# EAGLE design shieldv1.0 (EAGLE 7.5.0)
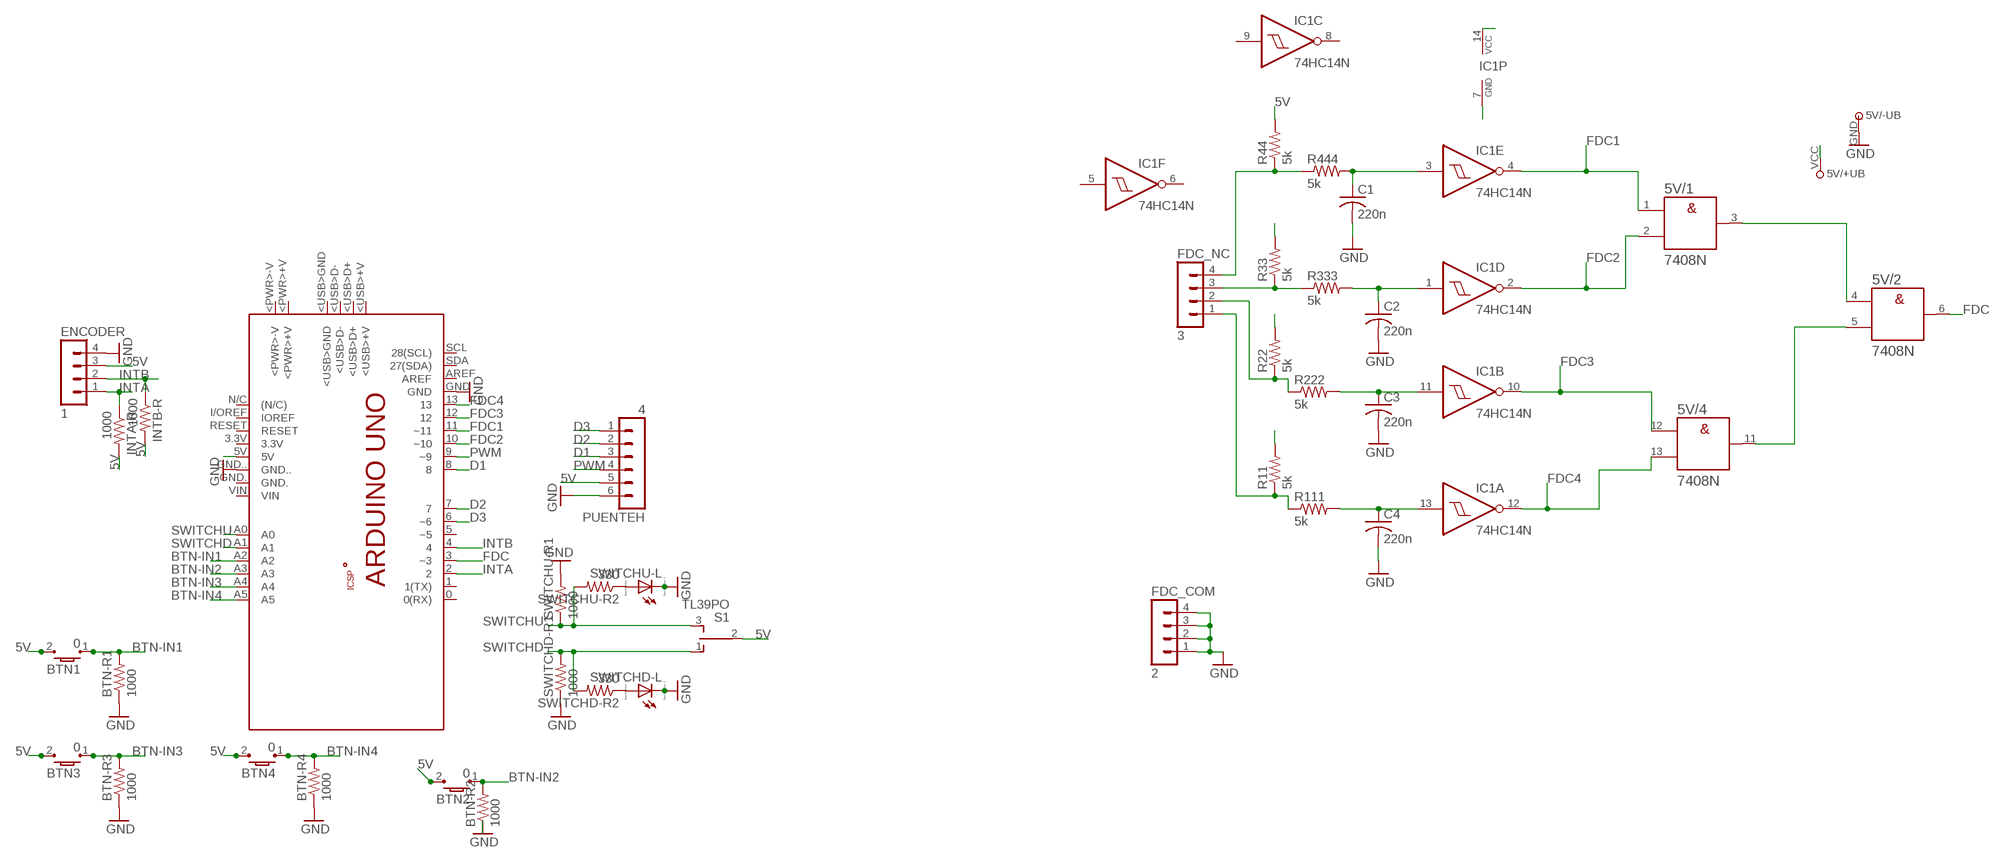
[diagram p0: schematic, sheet 1]

## Parts
5V  7408N  [DIL14]
BTN1  0  TL3302-J  [TL3303_J]
BTN2  0  TL3302-J  [TL3303_J]
BTN3  0  TL3302-J  [TL3303_J]
BTN4  0  TL3302-J  [TL3303_J]
BTN-R1  1000  R-US_0204/7  [0204/7]
BTN-R2  1000  R-US_0204/7  [0204/7]
BTN-R3  1000  R-US_0204/7  [0204/7]
BTN-R4  1000  R-US_0204/7  [0204/7]
C1  220n  C-US025-030X050  [C025-030X050]
C2  220n  C-US025-030X050  [C025-030X050]
C3  220n  C-US025-030X050  [C025-030X050]
C4  220n  C-US025-030X050  [C025-030X050]
ENCODER  1  MA04-1  [MA04-1]
FDC_COM  2  MA04-1  [MA04-1]
FDC_NC  3  MA04-1  [MA04-1]
IC1  74HC14N  [DIL14]
INTA-R  1000  R-US_0204/7  [0204/7]
INTB-R  1000  R-US_0204/7  [0204/7]
PCB1  ARDUINO_UNO  [ARDUINO_UNO]
PUENTEH  4  MA06-1  [MA06-1]
R11  5k  R-US_0204/7  [0204/7]
R22  5k  R-US_0204/7  [0204/7]
R33  5k  R-US_0204/7  [0204/7]
R44  5k  R-US_0204/7  [0204/7]
R111  5k  R-US_0204/7  [0204/7]
R222  5k  R-US_0204/7  [0204/7]
R333  5k  R-US_0204/7  [0204/7]
R444  5k  R-US_0204/7  [0204/7]
S1  TL39PO  [TL3XPO]
SWITCHD-L  LED_ELD260  [LED_LD260]
SWITCHD-R1  1000  R-US_0204/7  [0204/7]
SWITCHD-R2  330  R-US_0204/7  [0204/7]
SWITCHU-L  LED_ELD260  [LED_LD260]
SWITCHU-R1  1000  R-US_0204/7  [0204/7]
SWITCHU-R2  330  R-US_0204/7  [0204/7]

## Nets
5V: 5V.VCC(/+UB:+UB) BTN1.2 BTN2.2 BTN3.2 BTN4.2 ENCODER.3 IC1.14(P:VCC) INTA-R.2 INTB-R.2 PCB1.5V PUENTEH.5 R11.2 R22.2 R33.2 R44.2 S1.2(P)
BTN-IN1: BTN1.1 BTN-R1.2 PCB1.A2
BTN-IN2: BTN2.1 BTN-R2.2 PCB1.A3
BTN-IN3: BTN3.1 BTN-R3.2 PCB1.A4
BTN-IN4: BTN4.1 BTN-R4.2 PCB1.A5
D1: PCB1.8 PUENTEH.3
D2: PCB1.7 PUENTEH.2
D3: PCB1.6(~6) PUENTEH.1
FDC: 5V.6(/2:Y) PCB1.3(~3)
FDC1: 5V.1(/1:A) IC1.4(E:O) PCB1.11(~11)
FDC2: 5V.2(/1:B) IC1.2(D:O) PCB1.10(~10)
FDC3: 5V.12(/4:A) IC1.10(B:O) PCB1.12
FDC4: 5V.13(/4:B) IC1.12(A:O) PCB1.13
GND: 5V.GND(/-UB:-UB) BTN-R1.1 BTN-R2.1 BTN-R3.1 BTN-R4.1 C1.2 C2.2 C3.2 C4.2 ENCODER.4 FDC_COM.1 FDC_COM.2 FDC_COM.3 FDC_COM.4 IC1.7(P:GND) PCB1.GND PCB1.GND.. PUENTEH.6 SWITCHD-L.K(C) SWITCHD-R1.1 SWITCHU-L.K(C) SWITCHU-R1.2
INTA: ENCODER.1 INTA-R.1 PCB1.2
INTB: ENCODER.2 INTB-R.1 PCB1.4
N$1: FDC_NC.3 R33.1 R333.1
N$3: SWITCHU-L.A SWITCHU-R2.1
N$4: SWITCHD-L.A SWITCHD-R2.1
N$5: FDC_NC.4 R44.1 R444.1
N$8: C1.1 IC1.3(E:I) R444.2
N$10: C2.1 IC1.1(D:I) R333.2
N$11: FDC_NC.2 R22.1 R222.1
N$12: C3.1 IC1.11(B:I) R222.2
N$13: FDC_NC.1 R11.1 R111.1
N$14: C4.1 IC1.13(A:I) R111.2
N$19: 5V.5(/2:B) 5V.11(/4:Y)
N$20: 5V.3(/1:Y) 5V.4(/2:A)
PWM: PCB1.9(~9) PUENTEH.4
SWITCHD: PCB1.A1 S1.1(O) SWITCHD-R1.2 SWITCHD-R2.2
SWITCHU: PCB1.A0 S1.3(S) SWITCHU-R1.1 SWITCHU-R2.2
Unconnected: 5V.8(/3:Y) 5V.9(/3:A) 5V.10(/3:B) IC1.5(F:I) IC1.6(F:O) IC1.8(C:O) IC1.9(C:I) PCB1.0(0(RX)) PCB1.1(1(TX)) PCB1.3.3V PCB1.5(~5) PCB1.+5V PCB1.<PWR>+V PCB1.<PWR>-V PCB1.<USB>+V PCB1.<USB>D+ PCB1.<USB>D- PCB1.<USB>GND PCB1.AREF PCB1.GND. PCB1.GND_ PCB1.I/OREF(IOREF) PCB1.MISO PCB1.MOSI PCB1.N/C((N/C)) PCB1.RESET PCB1.RESET. PCB1.SCK PCB1.SCL(28(SCL)) PCB1.SDA(27(SDA)) PCB1.VIN

## Library data of the parts
5V = 74ttl-din:74*08: Quad 2-input AND gate
BTN1-BTN4 = eswitch-tact:TL3302: E-Switch TL3302 Series Tactile Switch Surface mount button commonly used for reset or general input. 3.5 x 6mm packaged design. -G: Gull wing termination. Parts TL-3302-x-xxxx-x-G -J: J-Lead termination. Parts TL-3302-x-xxxx-x-J Source: http://www.e-switch.com/Portals/0/Series_Pdf/TL3302.pdf Supplier: DigiKey: http://be.digikey.com/scripts/dksearch/dksus.dll?vendor=0&keywords=TL3302
BTN-R1-BTN-R4 INTA-R INTB-R SWITCHD-R1 SWITCHD-R2 SWITCHU-R1 SWITCHU-R2 = resistor:R-US_: RESISTOR, American symbol
C1-C4 = rcl:C-US: CAPACITOR, American symbol
ENCODER FDC_COM FDC_NC = con-lstb:MA04-1: PIN HEADER; OC_FARNELL: unknown; OC_NEWARK: unknown
IC1 = 74xx-eu:74*14: Hex schmitt trigger INVERTER
PCB1 = uchile_robotics_eagle_library:ARDUINO_UNO: Device for representing an Arduino Uno board with a footprint in an EAGLE design. Created by Dave Young for Element14. More EAGLE documentation at: http://www.element14.com/community/community/knode/cadsoft_eagle
PUENTEH = con-lstb:MA06-1: PIN HEADER; OC_FARNELL: unknown; OC_NEWARK: unknown
R11 R22 R33 R44 R111 R222 R333 R444 = rcl:R-US_: RESISTOR, American symbol
S1 = switch:TL39PO: TINY SWITCH ON OFF ON Source: http://www2.produktinfo.conrad.com/datenblaetter/700000-724999/705152-da-01-de-Subminiaturschalter_TL_36YO.pdf
SWITCHD-L SWITCHU-L = eagle-ltspice:LED_E: LED Source: http://www.osram.convergy.de Source: www.luxeon.com Source: www.kingbright.com; SPICEMODEL: NONE; SPICEPREFIX: D; SPICETYPE: diode

## Board
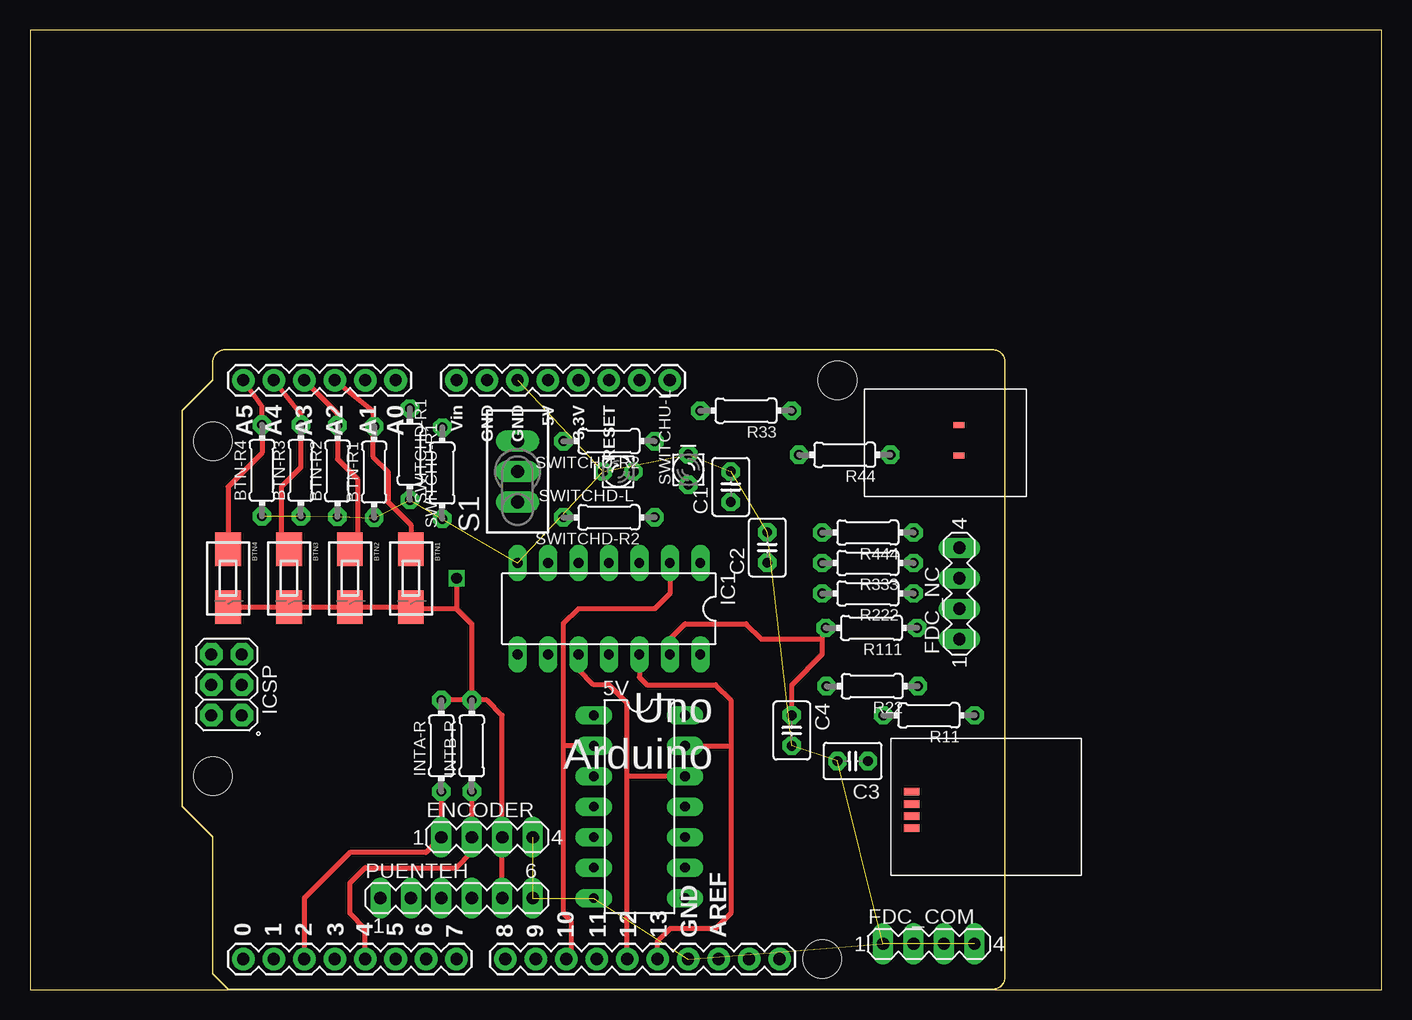
[diagram p1: board, top side]
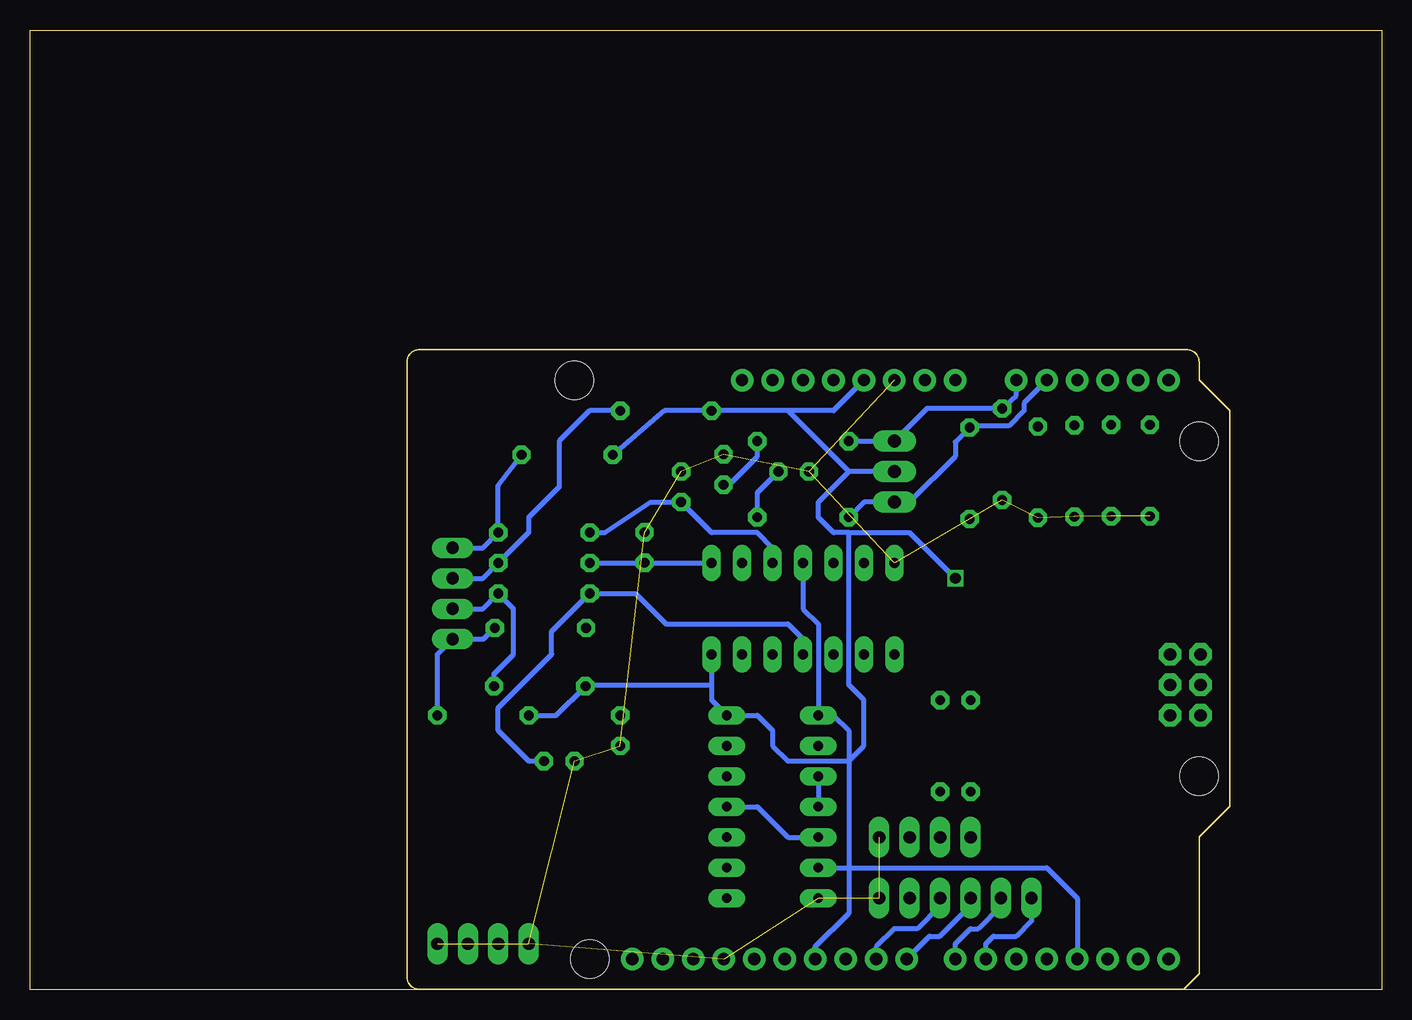
[diagram p2: board, bottom side, seen from below]

Size 112.7 x 80 mm. Coordinates in mm from the lower left corner, seen from the top.
Outline: 0,0 112.7,0 112.7,80 0,80 0,0
Copper layers (1*16): Top 0.035mm / dielectric 1.5mm / Bottom 0.035mm
Design rules "drc_config *": minimum track width 10mil, minimum drill 24mil, track to track 16mil, track to pad 10mil, pad to pad 16mil, via to via 16mil, smd to smd 16mil, copper to edge 40mil, drill to drill 8mil, minimum pad ring 14mil, minimum via ring 8mil, stop-mask expansion 4mil, vias tented up to drill 0mil, thermal gap 20mil

### Footprints (pad centres in the part's own frame; a part is rotated, then mirrored left to right if it is on the bottom)
DIL14 = drill 0.813 long: 1 -7.62,-3.81; 2 -5.08,-3.81; 3 -2.54,-3.81; 4 0,-3.81; 5 2.54,-3.81; 6 5.08,-3.81; 8 7.62,3.81; 9 5.08,3.81; 10 2.54,3.81; 11 0,3.81; 12 -2.54,3.81; 13 -5.08,3.81; GND 7.62,-3.81; VCC -7.62,3.81
TL3303_J = smd 2.794 x 2.159: 1 -2.413,0; 2 2.413,0
0204/7 = drill 0.813 octagon: 1 -3.81,0; 2 3.81,0
C025-030X050 = drill 0.813 octagon: 1 -1.27,0; 2 1.27,0
MA04-1 = drill 1.016 long: 1 -3.81,0; 2 -1.27,0; 3 1.27,0; 4 3.81,0
DIL14' = drill 0.813 long: 1 -7.62,-3.81; 2 -5.08,-3.81; 3 -2.54,-3.81; 4 0,-3.81; 5 2.54,-3.81; 6 5.08,-3.81; 7 7.62,-3.81; 8 7.62,3.81; 9 5.08,3.81; 10 2.54,3.81; 11 0,3.81; 12 -2.54,3.81; 13 -5.08,3.81; 14 -7.62,3.81
ARDUINO_UNO = drill 1.016 pad 1.88: 0 63.5,50.8; 1 60.96,50.8; 2 58.42,50.8; 3 55.88,50.8; 3.3V 35.56,2.54; 4 53.34,50.8; 5 50.8,50.8; 5V 38.1,2.54; 6 48.26,50.8; 7 45.72,50.8; 8 41.656,50.8; 9 39.116,50.8; 10 36.576,50.8; 11 34.036,50.8; 12 31.496,50.8; 13 28.956,50.8; A0 50.8,2.54; A1 53.34,2.54; A2 55.88,2.54; A3 58.42,2.54; A4 60.96,2.54; A5 63.5,2.54; AREF 23.876,50.8; GND 26.416,50.8; GND. 43.18,2.54; GND.. 40.64,2.54; I/OREF 30.48,2.54; N/C 27.94,2.54; RESET 33.02,2.54; SCL 18.796,50.8; SDA 21.336,50.8; VIN 45.72,2.54 | drill 1.016 pad 1.88 octagon: +5V 66.167,30.48; GND_ 66.167,25.4; MISO 63.627,30.48; MOSI 66.167,27.94; RESET. 63.627,25.4; SCK 63.627,27.94 | smd 1.016 x 0.508: <PWR>+V 3.861,8.814; <PWR>-V 3.861,6.274 | smd 1.27 x 0.635: <USB>+V 7.772,39.878; <USB>D+ 7.772,38.887; <USB>D- 7.772,37.871; <USB>GND 7.772,36.83 | hole 3.2: 66.04,7.62; 66.04,35.56; 15.24,50.8; 13.97,2.54
MA06-1 = drill 1.016 long: 1 -6.35,0; 2 -3.81,0; 3 -1.27,0; 4 1.27,0; 5 3.81,0; 6 6.35,0
TL3XPO = drill 1.1 pad 1.422 long: 1 -2.54,0; 2 0,0; 3 2.54,0
LED_LD260 = drill 0.813 octagon: A -1.27,0; K 1.27,0

### Placement (x,y rotation side)
5V  50.8,15.24 270 top
BTN1  31.75,34.29 270 top
BTN2  26.67,34.29 270 top
BTN3  21.59,34.29 270 top
BTN4  16.51,34.29 270 top
BTN-R1  28.69,43.13 90 top
BTN-R2  25.63,43.23 90 top
BTN-R3  22.58,43.27 90 top
BTN-R4  19.34,43.27 90 top
C1  58.42,41.91 90 top
C2  61.47,36.85 90 top
C3  68.58,19.05 180 top
C4  63.5,21.59 270 top
ENCODER  38.1,12.7 0 top
FDC_COM  74.93,3.81 0 top
FDC_NC  77.47,33.02 90 top
IC1  74HC14N  [DIL14']  48.26,31.75 180 top
INTA-R  34.29,20.32 90 top
INTB-R  36.83,20.32 90 top
PCB1  81.28,53.34 180 top
PUENTEH  35.56,7.62 0 top
R11  74.93,22.86 180 top
R22  70.21,25.29 180 top
R33  59.69,48.26 180 top
R44  67.92,44.58 180 top
R111  70.15,30.15 180 top
R222  69.85,33.02 180 top
R333  69.85,35.56 180 top
R444  69.85,38.1 180 top
S1  40.64,43.18 90 top
SWITCHD-L  49.04,43.18 180 top
SWITCHD-R1  34.37,43.05 90 top
SWITCHD-R2  48.26,39.37 180 top
SWITCHU-L  54.88,43.35 90 top
SWITCHU-R1  31.66,44.63 270 top
SWITCHU-R2  48.26,45.72 180 top

### Tracks (layer width: path | path; a pad name or v marks a point on that pad's centre or on a via)
5V  (via drill 0.9)
  Top 0.406: BTN4.2 BTN3.2 BTN2.2 BTN1.2 31.88,31.75 35.56,31.75 | PUENTEH.5 ENCODER.3 39.37,22.86 38.1,24.13 INTB-R.2 | INTB-R.2 INTA-R.2 | 35.56,31.75 36.83,30.48 INTB-R.2 | v35.56,34.29 35.56,31.75
  Bottom 0.406: PCB1.5V 45.72,48.26 49.53,48.26 | 49.53,48.26 R33.2 59.79,48.26 R44.2 | R11.2 68.83,22.86 R22.2 66.29,25.4 55.88,25.4 | 44.45,43.18 49.53,48.26 | 55.88,25.4 55.88,24.13 5V.VCC 52.07,22.86 50.8,21.59 50.8,20.32 49.53,19.05 44.45,19.05 43.18,20.32 43.18,24.13 44.45,25.4 44.45,38.1 | S1.2 44.45,43.18 | 44.45,43.18 46.99,40.64 46.99,39.37 45.72,38.1 44.45,38.1 | 44.45,38.1 39.37,38.1 v35.56,34.29 | IC1.14 55.88,25.4
BTN-IN1
  Top 0.406: 31.66,36.79 BTN1.1 31.75,38.73 29.84,40.64 29.84,43.18 28.57,44.45 28.57,46.83 BTN-R1.2 28.64,46.99 28.57,48.26 PCB1.A2
BTN-IN2
  Top 0.406: BTN2.1 27.3,37.34 27.3,42.55 25.63,44.22 BTN-R2.2 25.63,48.03 PCB1.A3
BTN-IN3
  Top 0.406: BTN3.1 20.95,37.34 20.95,41.91 22.58,43.53 BTN-R3.2 22.58,47.98 PCB1.A4
BTN-IN4
  Top 0.406: BTN4.1 16.51,41.91 19.34,44.74 BTN-R4.2 19.34,48.61 PCB1.A5
D1
  Bottom 0.406: PUENTEH.3 34.29,6.99 36.83,4.45 37.72,4.45 PCB1.8
D2
  Bottom 0.406: PUENTEH.2 31.75,6.99 33.66,5.08 34.29,5.08 35.56,3.81 PCB1.7
D3
  Bottom 0.406: PUENTEH.1 29.21,5.71 30.48,4.45 32.38,4.45 33.02,3.81 PCB1.6
FDC
  Bottom 0.406: 5V.6 27.94,10.16 25.4,7.62 PCB1.3
FDC1
  Bottom 0.406: IC1.4 48.26,31.75 46.99,30.48 5V.1 45.72,22.86 44.45,21.59 44.45,6.35 47.24,3.56 PCB1.11
FDC2
  Top 0.406: IC1.2 53.34,33.02 52.07,31.75 45.72,31.75 44.45,30.48 44.45,20.32 | 5V.2 44.45,20.32 | 44.45,20.32 44.45,6.35 45.08,5.71 45.08,2.92 PCB1.10
FDC3
  Top 0.406: PCB1.12 49.78,17.78 | 49.78,17.78 49.78,23.88 48.26,25.4 46.99,25.4 45.72,26.67 IC1.10 | 5V.12 49.78,17.78
FDC4
  Top 0.406: IC1.12 50.8,26.04 51.44,25.4 57.15,25.4 58.42,24.13 58.42,20.32 | 58.42,20.32 58.42,6.35 57.15,5.08 53.34,5.08 52.32,4.06 PCB1.13 | 5V.13 58.42,20.32
GND  (21 unrouted)
INTA
  Top 0.406: INTA-R.1 ENCODER.1 33.02,11.43 26.67,11.43 22.86,7.62 PCB1.2
INTB
  Top 0.406: INTB-R.1 ENCODER.2 36.83,11.43 35.56,10.16 27.94,10.16 26.67,8.89 26.67,6.35 27.94,5.08 PCB1.4
N$1
  Bottom 0.406: FDC_NC.3 74.93,34.29 R333.1 71.12,38.1 71.12,39.37 68.58,41.91 68.58,45.72 66.04,48.26 R33.1
N$3
  Bottom 0.406: SWITCHU-L.A 54.44,42.08 52.07,44.45 SWITCHU-R2.1
N$4
  Bottom 0.406: SWITCHD-R2.1 52.07,41.42 SWITCHD-L.A
N$5
  Bottom 0.406: FDC_NC.4 74.93,36.83 R444.1 73.66,42.01 R44.1
N$8
  Bottom 0.406: R444.2 64.77,38.1 60.96,40.64 C1.1 55.88,38.1 52.07,38.1 50.8,36.83 IC1.3
N$10
  Bottom 0.406: R333.2 61.49,35.56 C2.1 61.44,35.56 IC1.1
N$11
  Bottom 0.406: FDC_NC.2 74.93,31.75 R222.1 72.39,31.75 72.39,27.94 74.02,26.31 R22.1
N$12
  Bottom 0.406: C3.1 71.12,19.05 73.66,21.59 73.66,23.5 69.22,27.94 69.22,29.84 R222.2 62.23,33.02 59.69,30.48 49.53,30.48 48.26,29.21 IC1.11
N$13
  Bottom 0.406: R111.1 74.89,29.21 FDC_NC.1 78.74,27.94 R11.1
N$14
  Top 0.406: C4.1 63.5,25.4 66.04,27.94 66.04,29.21 | IC1.13 53.34,29.21 54.61,30.48 59.69,30.48 60.96,29.21 66.04,29.21 | R111.2 66.04,29.85 66.04,29.21
N$19
  Bottom 0.406: 5V.11 52.07,15.24 49.53,12.7 5V.5
N$20
  Bottom 0.406: 5V.3 5V.4
PWM
  Bottom 0.406: PUENTEH.4 36.83,6.99 38.73,5.08 40.64,5.08 42.16,3.56 PCB1.9
SWITCHD
  Bottom 0.406: PCB1.A1 29.84,48.9 29.84,48.26 31.11,46.99 34.24,46.99 SWITCHD-R1.2 35.56,45.67 35.56,44.45 39.37,40.64 S1.1 43.18,40.64 SWITCHD-R2.2
SWITCHU
  Bottom 0.406: SWITCHU-R2.2 S1.3 37.92,48.44 SWITCHU-R1.1 30.48,49.53 PCB1.A0